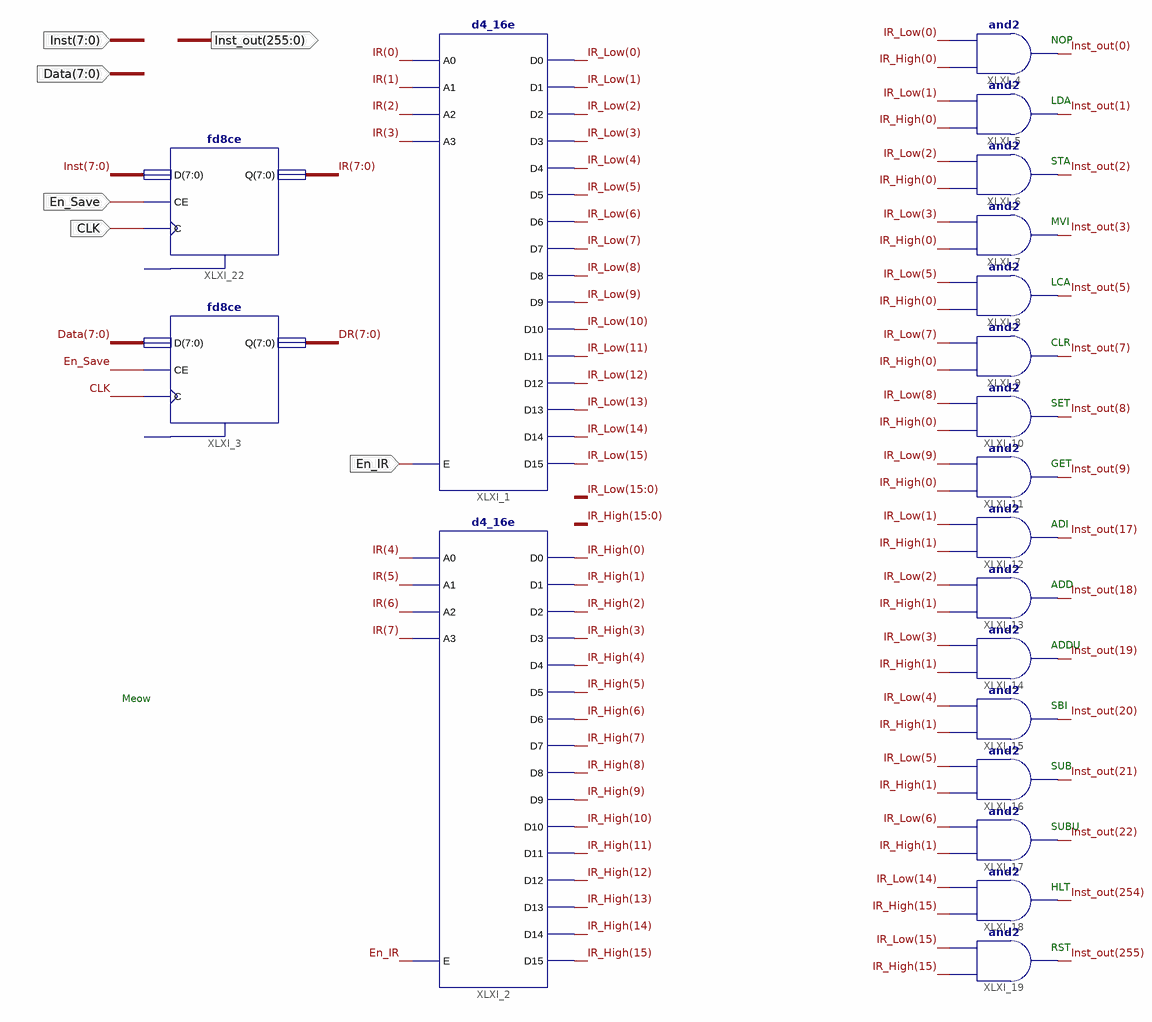
[diagram p0: schematic sheet 1]
// Xilinx ISE schematic ControlUnit.sch (spartan3e) as structural Verilog: 20 symbols, 6 ports
module ControlUnit (
  input  [7:0] Inst,
  input  En_IR,
  input  En_Save,
  input  [7:0] Data,
  input  CLK,
  output [255:0] Inst_out
);

  wire [7:0] DR, IR;
  wire [15:0] IR_High, IR_Low;

  d4_16e XLXI_1 (
    .A0(IR[0]), .A1(IR[1]), .A2(IR[2]), .A3(IR[3]), .E(En_IR), .D0(IR_Low[0]), .D1(IR_Low[1]),
    .D10(IR_Low[10]), .D11(IR_Low[11]), .D12(IR_Low[12]), .D13(IR_Low[13]), .D14(IR_Low[14]),
    .D15(IR_Low[15]), .D2(IR_Low[2]), .D3(IR_Low[3]), .D4(IR_Low[4]), .D5(IR_Low[5]), .D6(IR_Low[6]),
    .D7(IR_Low[7]), .D8(IR_Low[8]), .D9(IR_Low[9]));
  d4_16e XLXI_2 (
    .A0(IR[4]), .A1(IR[5]), .A2(IR[6]), .A3(IR[7]), .E(En_IR), .D0(IR_High[0]), .D1(IR_High[1]),
    .D10(IR_High[10]), .D11(IR_High[11]), .D12(IR_High[12]), .D13(IR_High[13]), .D14(IR_High[14]),
    .D15(IR_High[15]), .D2(IR_High[2]), .D3(IR_High[3]), .D4(IR_High[4]), .D5(IR_High[5]), .D6(IR_High[6]),
    .D7(IR_High[7]), .D8(IR_High[8]), .D9(IR_High[9]));
  and XLXI_4 (Inst_out[0], IR_High[0], IR_Low[0]);
  and XLXI_5 (Inst_out[1], IR_High[0], IR_Low[1]);
  and XLXI_6 (Inst_out[2], IR_High[0], IR_Low[2]);
  and XLXI_7 (Inst_out[3], IR_High[0], IR_Low[3]);
  and XLXI_8 (Inst_out[5], IR_High[0], IR_Low[5]);
  and XLXI_9 (Inst_out[7], IR_High[0], IR_Low[7]);
  and XLXI_10 (Inst_out[8], IR_High[0], IR_Low[8]);
  and XLXI_11 (Inst_out[9], IR_High[0], IR_Low[9]);
  and XLXI_12 (Inst_out[17], IR_High[1], IR_Low[1]);
  and XLXI_13 (Inst_out[18], IR_High[1], IR_Low[2]);
  and XLXI_14 (Inst_out[19], IR_High[1], IR_Low[3]);
  and XLXI_15 (Inst_out[20], IR_High[1], IR_Low[4]);
  and XLXI_16 (Inst_out[21], IR_High[1], IR_Low[5]);
  and XLXI_17 (Inst_out[22], IR_High[1], IR_Low[6]);
  and XLXI_18 (Inst_out[254], IR_High[15], IR_Low[14]);
  and XLXI_19 (Inst_out[255], IR_High[15], IR_Low[15]);
  fd8ce XLXI_22 (.C(CLK), .CE(En_Save), .D(Inst), .Q(IR));  // open: CLR
  fd8ce XLXI_3 (.C(CLK), .CE(En_Save), .D(Data), .Q(DR));  // open: CLR

  // Notes on the sheet:
  //   NOP
  //   LDA
  //   STA
  //   MVI
  //   LCA
  //   CLR
  //   SET
  //   GET
  //   ADI
  //   ADD
  //   ADDU
  //   Meow
  //   SBI
  //   SUB
  //   SUBU
  //   HLT
  //   RST
endmodule
